# Altium schematic sheet PiPico.SchDoc
size A4; SheetNumber: 2; SheetTotal: 3
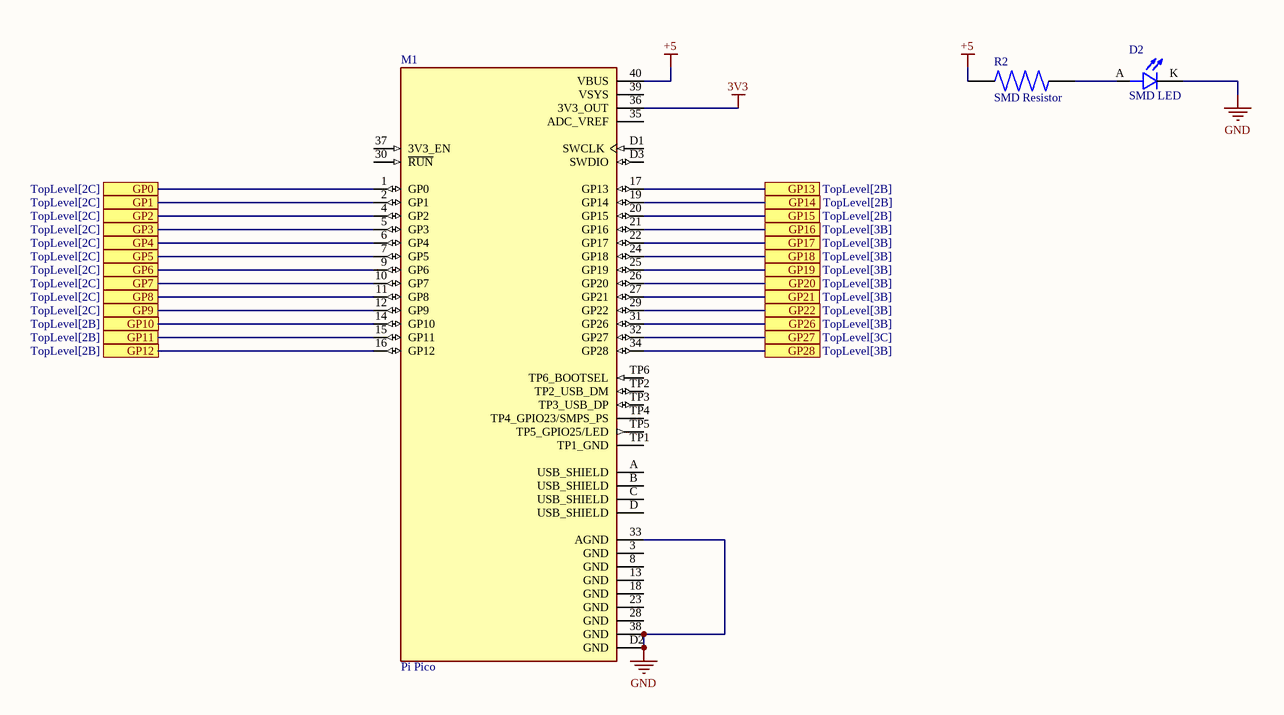
[diagram p0: PiPico.SchDoc]

## Parts
D2  SMD LED  [SMD LED-Footprint-1]
M1  Pi Pico  [Pi Pico-Footprint-1]
R2  SMD Resistor  [SMD Resistor-Footprint-1]

## Ports
GP0 (see TopLevel[2C]), GP1 (see TopLevel[2C]), GP2 (see TopLevel[2C]), GP3 (see TopLevel[2C]), GP4 (see TopLevel[2C]), GP5 (see TopLevel[2C]), GP6 (see TopLevel[2C]), GP7 (see TopLevel[2C]), GP8 (see TopLevel[2C]), GP9 (see TopLevel[2C]), GP10 (see TopLevel[2B]), GP11 (see TopLevel[2B]), GP12 (see TopLevel[2B]), GP13 (see TopLevel[2B]), GP14 (see TopLevel[2B]), GP15 (see TopLevel[2B]), GP16 (see TopLevel[3B]), GP17 (see TopLevel[3B]), GP18 (see TopLevel[3B]), GP19 (see TopLevel[3B]), GP20 (see TopLevel[3B]), GP21 (see TopLevel[3B]), GP22 (see TopLevel[3B]), GP26 (see TopLevel[3B]), GP27 (see TopLevel[3C]), GP28 (see TopLevel[3B])

## Nets
3V3: M1.36(3V3_OUT)
+5: M1.40(VBUS) R2.1
GND: D2.K(C) M1.33(AGND) M1.38(GND) M1.D2(GND)
GP0: M1.1(GP0) ; port GP0
GP1: M1.2(GP1) ; port GP1
GP2: M1.4(GP2) ; port GP2
GP3: M1.5(GP3) ; port GP3
GP4: M1.6(GP4) ; port GP4
GP5: M1.7(GP5) ; port GP5
GP6: M1.9(GP6) ; port GP6
GP7: M1.10(GP7) ; port GP7
GP8: M1.11(GP8) ; port GP8
GP9: M1.12(GP9) ; port GP9
GP10: M1.14(GP10) ; port GP10
GP11: M1.15(GP11) ; port GP11
GP12: M1.16(GP12) ; port GP12
GP13: M1.17(GP13) ; port GP13
GP14: M1.19(GP14) ; port GP14
GP15: M1.20(GP15) ; port GP15
GP16: M1.21(GP16) ; port GP16
GP17: M1.22(GP17) ; port GP17
GP18: M1.24(GP18) ; port GP18
GP19: M1.25(GP19) ; port GP19
GP20: M1.26(GP20) ; port GP20
GP21: M1.27(GP21) ; port GP21
GP22: M1.29(GP22) ; port GP22
GP26: M1.31(GP26) ; port GP26
GP27: M1.32(GP27) ; port GP27
GP28: M1.34(GP28) ; port GP28
NetD2_A: D2.A R2.2

Not connected (* = marked no-connect by the designer): M1 3(GND) 8(GND) 13(GND) 18(GND) 23(GND) 28(GND) 30(~{RUN}) 35(ADC_VREF) 37(3V3_EN) 39(VSYS) A(USB_SHIELD) B(USB_SHIELD) C(USB_SHIELD) D(USB_SHIELD) D1(SWCLK) D3(SWDIO) TP1(TP1_GND) TP2(TP2_USB_DM) TP3(TP3_USB_DP) TP4(TP4_GPIO23/SMPS_PS) TP5(TP5_GPIO25/LED) TP6(TP6_BOOTSEL)

## Library data of the parts
D2 = CMP-00018-3: Generic SMD LED
M1 = CMP-00035-2
R2 = CMP-00019-2: Generic SMD Resistor